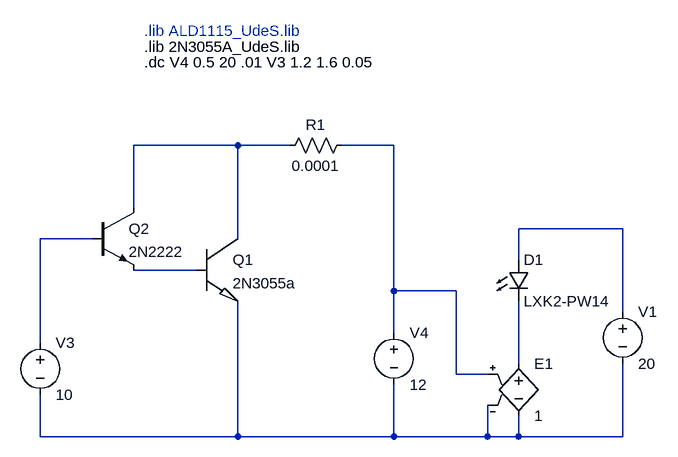
[diagram p0: schematic Draft2.asc]
Draft2.asc, the LTspice schematic file:
Version 4
SHEET 1 880 680
WIRE 112 -32 -48 -32
WIRE 192 -32 112 -32
WIRE 352 -32 272 -32
WIRE -48 64 -48 -32
WIRE 704 96 544 96
WIRE -112 112 -192 112
WIRE 112 112 112 -32
WIRE 544 144 544 96
WIRE 48 160 -48 160
WIRE 352 192 352 -32
WIRE 448 192 352 192
WIRE 704 224 704 96
WIRE 352 256 352 192
WIRE -192 272 -192 112
WIRE 544 304 544 208
WIRE 448 320 448 192
WIRE 496 320 448 320
WIRE -192 416 -192 352
WIRE 112 416 112 208
WIRE 112 416 -192 416
WIRE 352 416 352 336
WIRE 352 416 112 416
WIRE 496 416 496 368
WIRE 496 416 352 416
WIRE 544 416 544 384
WIRE 544 416 496 416
WIRE 704 416 704 304
WIRE 704 416 544 416
SYMBOL npn -112 64 R0
SYMATTR InstName Q2
SYMATTR Value 2N2222
SYMBOL voltage -192 256 R0
WINDOW 123 0 0 Left 0
WINDOW 39 0 0 Left 0
SYMATTR InstName V3
SYMATTR Value 10
SYMBOL 2N3055a 48 112 R0
SYMATTR InstName Q1
SYMBOL res 176 -16 R270
WINDOW 0 32 56 VTop 2
WINDOW 3 0 56 VBottom 2
SYMATTR InstName R1
SYMATTR Value 0.0001
SYMBOL voltage 352 240 R0
WINDOW 123 0 0 Left 0
WINDOW 39 0 0 Left 0
SYMATTR InstName V4
SYMATTR Value 12
SYMBOL e 544 288 R0
SYMATTR InstName E1
SYMATTR Value 1
SYMBOL LED 528 144 R0
SYMATTR InstName D1
SYMATTR Value LXK2-PW14
SYMATTR Description Diode
SYMATTR Type diode
SYMBOL voltage 704 208 R0
WINDOW 123 0 0 Left 0
WINDOW 39 0 0 Left 0
SYMATTR InstName V1
SYMATTR Value 20
TEXT -32 -208 Left 2 ;.lib ALD1115_UdeS.lib
TEXT -32 -184 Left 2 !.lib 2N3055A_UdeS.lib
TEXT -32 -160 Left 2 !.dc V4 0.5 20 .01 V3 1.2 1.6 0.05

The netlist it stands for:
* Draft2.asc
Q2 N001 N004 N005 0 2N2222
V3 N004 N007 10
Q1 N001 N005 N007 0 2N3055a
R1 N001 N002 0.0001
V4 N002 N007 12
E1 N006 N007 N002 N007 1
D1 N003 N006 LXK2-PW14
V1 N003 N007 20
.model D D
.lib standard.dio
.model NPN NPN
.model PNP PNP
.lib standard.bjt
* .lib ALD1115_UdeS.lib
.lib 2N3055A_UdeS.lib
.dc V4 0.5 20 .01 V3 1.2 1.6 0.05
.lib 2N3055A_UdeS.lib
.backanno
.end